# EAGLE design sensor (EAGLE 7.7.0)
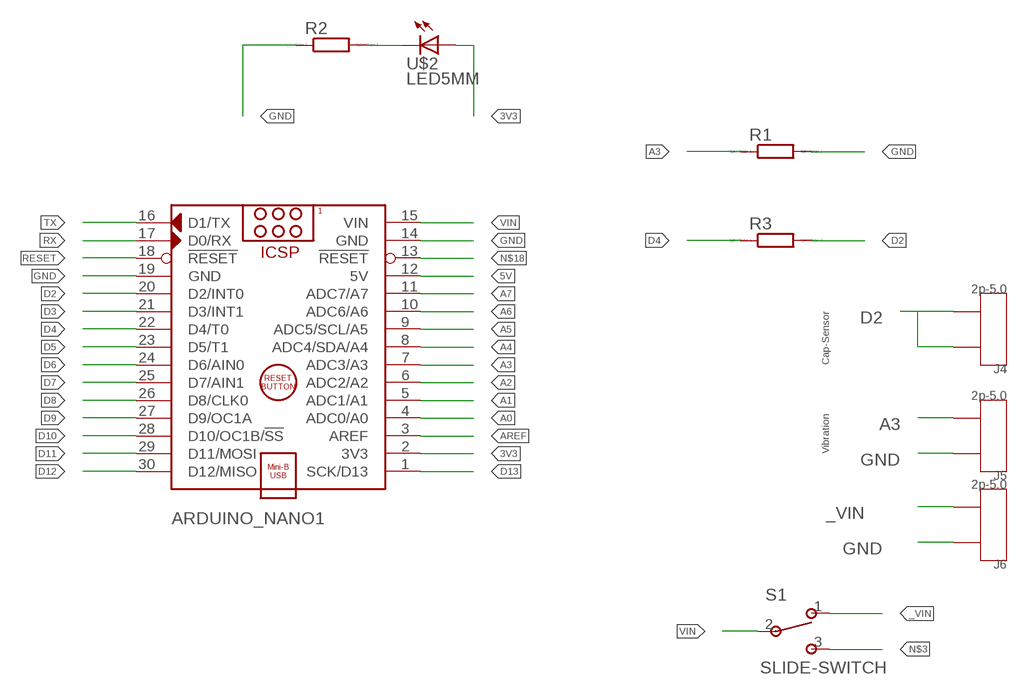
[diagram p0: schematic, sheet 1]

## Parts
ARDUINO_NANO1  ARDUINO_NANO  [ARDUINO_NANO]
J4  2p-5.0  DIP-FEMALE-BLUE(2P-5.0)  [H2-5.0]
J5  2p-5.0  DIP-FEMALE-BLUE(2P-5.0)  [H2-5.0]
J6  2p-5.0  DIP-FEMALE-BLUE(2P-5.0)  [H2-5.0]
R1  R0204/7  [0204/7]
R2  R0204/7  [0204/7]
R3  R0204/7  [0204/7]
S1  SLIDE-SWITCH  [AYZ0102AGRLC]
U$2  LED5MM  [5MM]

## Nets
3V3: ARDUINO_NANO1.2(3V3) U$2.IN(A)
5V: ARDUINO_NANO1.12(5V)
_VIN: J6.2 S1.1
A0: ARDUINO_NANO1.4(ADC0/A0)
A1: ARDUINO_NANO1.5(ADC1/A1)
A2: ARDUINO_NANO1.6(ADC2/A2)
A3: ARDUINO_NANO1.7(ADC3/A3) J5.2 R1.1
A4: ARDUINO_NANO1.8(ADC4/SDA/A4)
A5: ARDUINO_NANO1.9(ADC5/SCL/A5)
A6: ARDUINO_NANO1.10(ADC6/A6)
A7: ARDUINO_NANO1.11(ADC7/A7)
AREF: ARDUINO_NANO1.3(AREF)
D2: ARDUINO_NANO1.20(D2/INT0) J4.1 J4.2 R3.2
D3: ARDUINO_NANO1.21(D3/INT1)
D4: ARDUINO_NANO1.22(D4/T0) R3.1
D5: ARDUINO_NANO1.23(D5/T1)
D6: ARDUINO_NANO1.24(D6/AIN0)
D7: ARDUINO_NANO1.25(D7/AIN1)
D8: ARDUINO_NANO1.26(D8/CLK0)
D9: ARDUINO_NANO1.27(D9/OC1A)
D10: ARDUINO_NANO1.28(D10/OC1B/!SS)
D11: ARDUINO_NANO1.29(D11/MOSI)
D12: ARDUINO_NANO1.30(D12/MISO)
D13: ARDUINO_NANO1.1(SCK/D13)
GND: ARDUINO_NANO1.14(GND) ARDUINO_NANO1.19(GND) J5.1 J6.1 R1.2 R2.1
N$1: R2.2 U$2.OUT(C)
N$3: S1.3
N$18: ARDUINO_NANO1.13(!RESET)
RESET: ARDUINO_NANO1.18(!RESET)
RX: ARDUINO_NANO1.17(D0/RX)
TX: ARDUINO_NANO1.16(D1/TX)
VIN: ARDUINO_NANO1.15(VIN) S1.2

## Notes on the sheet
- Cap-Sensor
- Vibration

## Library data of the parts
ARDUINO_NANO1 = ArduinoNanoV30:ARDUINO_NANO: Arduino Nano V3.0 Module Overview: The Arduino Nano is a small, complete, and breadboard-friendly board based on the ATmega328 (Arduino Nano 3.x) or ATmega168 (Arduino Nano 2.x). It has more or less the same functionality of the Arduino Duemilanove, but in a different package. It lacks only a DC power jack, and works with a Mini-B USB cable instead of a standard one. The Nano was designed and is being produced by Gravitech <http://www.gravitech.us/arna30wiatp.html>. General specifications: Item Value Microcontroller Atmel ATmega168 or ATmega328 Operating Voltage (logic level) 5 V Input Voltage (recommended) 7-12 V Input Voltage (limits) 6-20 V Digital I/O Pins 14 (of which 6 provide PWM output) Analog Input Pins 8 DC Current per I/O Pin 40 mA Flash Memory 16 KB (ATmega168) or 32 KB (ATmega328) of which 2 KB used by bootloader SRAM 1 KB (ATmega168) or 2 KB (ATmega328) EEPROM 512 bytes (ATmega168) or 1 KB (ATmega328) Clock Speed 16 MHz Dimensions (Inches) 0.73" x 1.70" Dimensions (mm) 18mm x 45mm Overall height About 9 mm (not including pins) Weigth 5 g Power: The Arduino Nano can be powered via the Mini-B USB connection, 6-20V unregulated external power supply (pin 30), or 5V regulated external power supply (pin 27). The power source is automatically selected to the highest voltage source. Memory: The ATmega168 has 16 KB of flash memory for storing code (of which 2 KB is used for the bootloader); the ATmega328 has 32 KB, (also with 2 KB used for the bootloader). The ATmega168 has 1 KB of SRAM and 512 bytes of EEPROM (which can be read and written with the EEPROM library); the ATmega328 has 2 KB of SRAM and 1 KB of EEPROM. Input and Output: Each of the 14 digital pins on the Nano can be used as an input or output, using pinMode(), digitalWrite(), and digitalRead() functions. They operate at 5 volts. Each pin can provide or receive a maximum of 40 mA and has an internal pull-up resistor (disconnected by default) of 20-50 kOhms. In addition, some pins have specialized functions. Visit Arduino - ArduinoBoardNano <https://www.arduino.cc/en/Main/ArduinoBoardNano>
J4-J6 = Seeed-OPL-Connector:DIP-FEMALE-BLUE(2P-5.0): 320120007
R1-R3 = eagle-ltspice:R: RESISTOR, European symbol; SPICEMODEL: NONE; SPICEPREFIX: R
S1 = fab:SLIDE-SWITCH: SMD slide-switch AYZ0102AGRLC as found in the fablab inventory. Includes the mounting holes. Made by Zaerc.
U$2 = fab:LED: LED

## Board
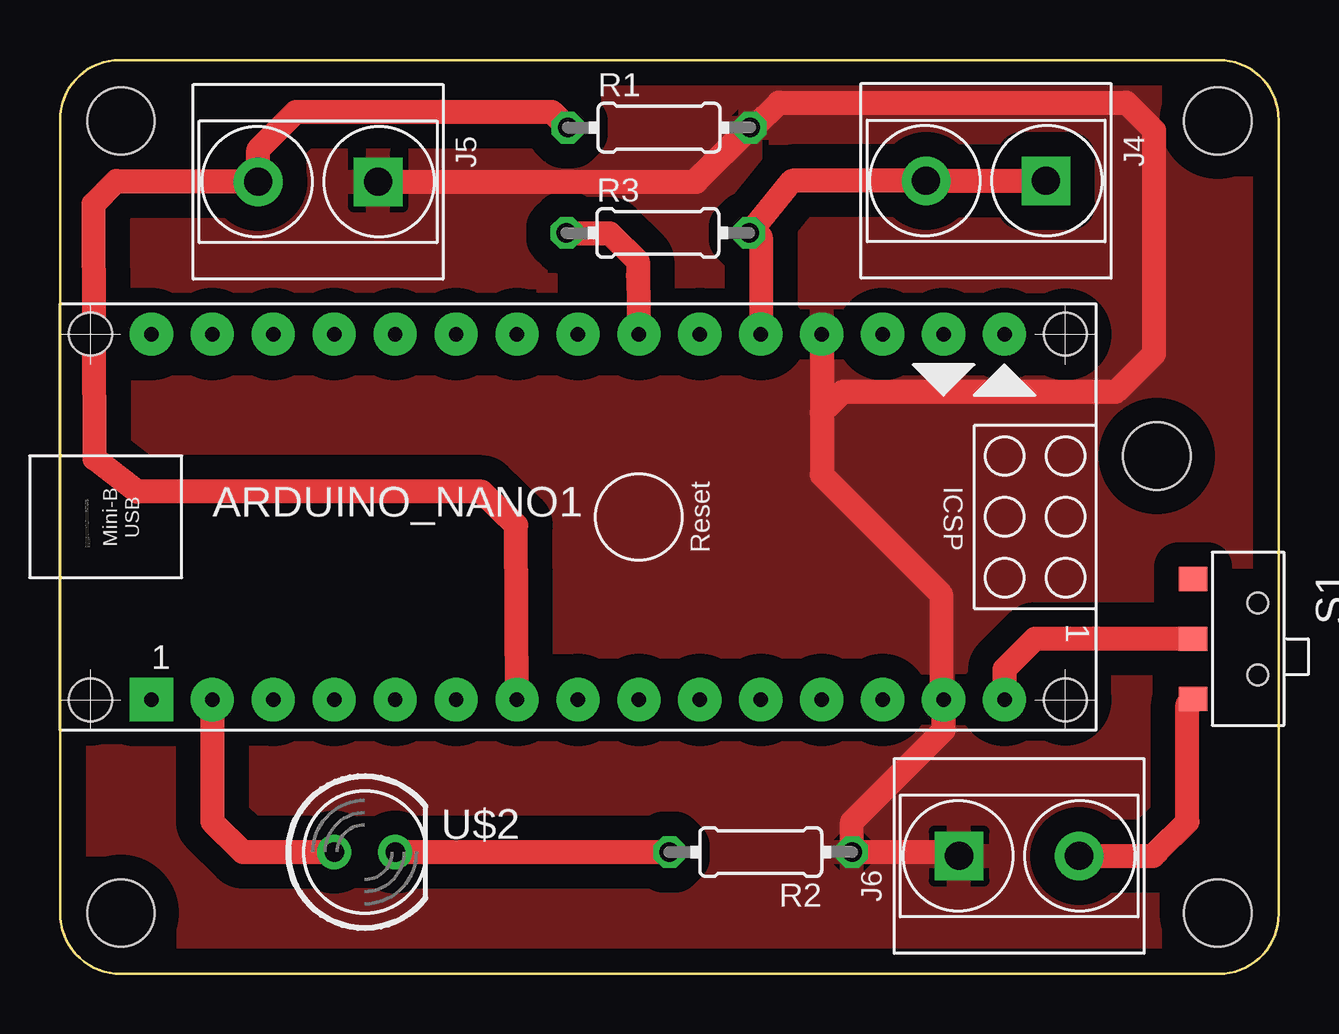
[diagram p1: board, top side]
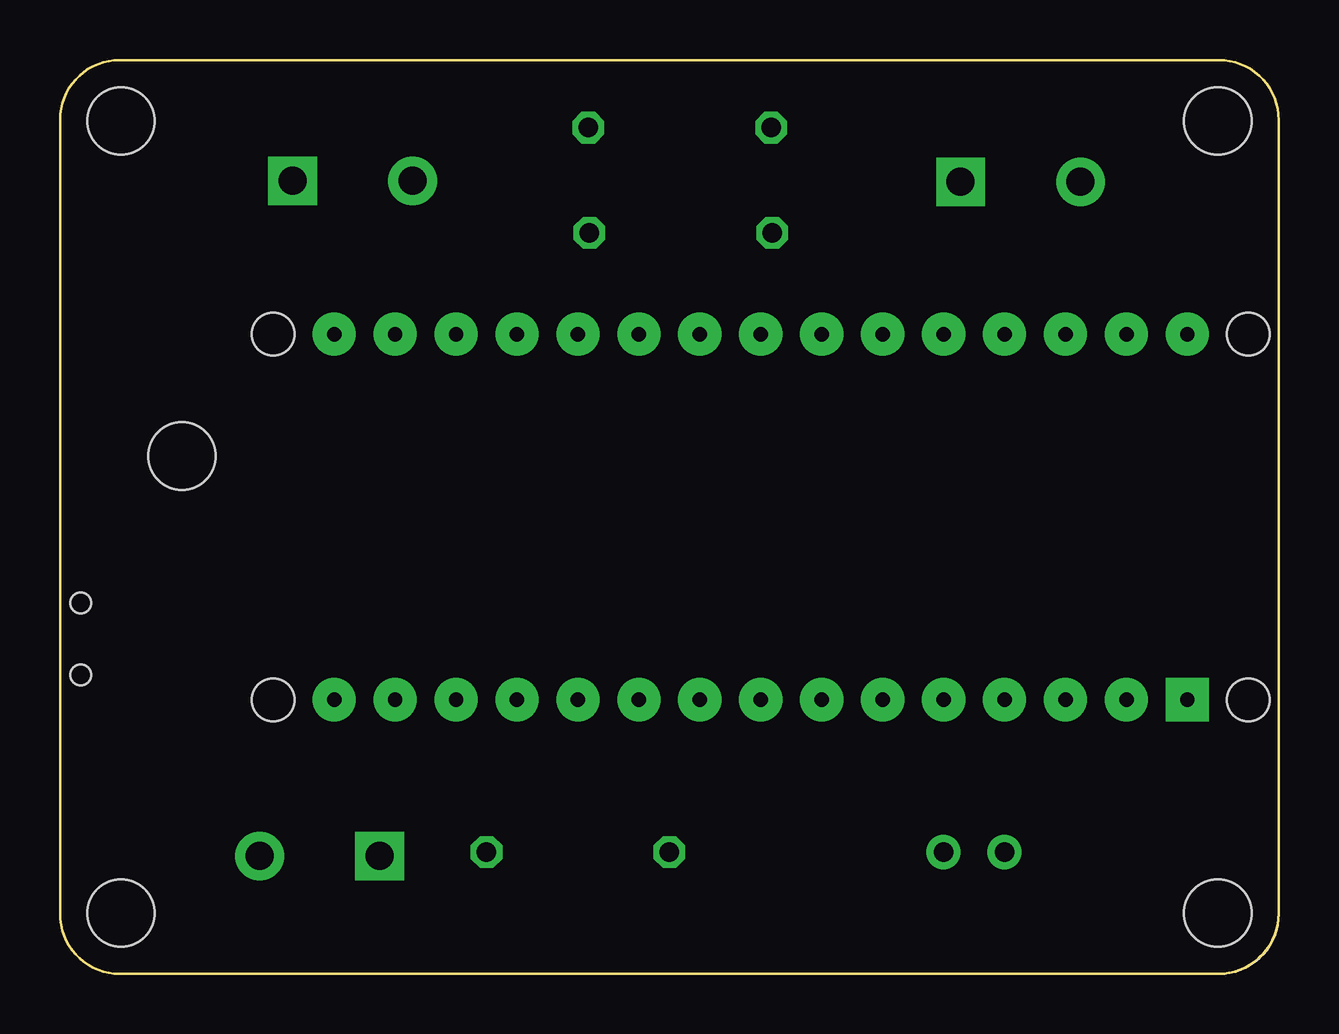
[diagram p2: board, bottom side, seen from below]

Size 50.8 x 38.1 mm. Coordinates in mm from the lower left corner, seen from the top.
Outline: 0,2.54 0,35.6 arc-90 2.5,38.1 48.3,38.1 arc-90 50.8,35.6 50.8,2.5 arc-90 48.3,0 2.54,0
Outline: 0,2.54 0,2.5
Outline: 2.5,0 2.54,0
Outline: 0,2.54 arc90 2.54,0
Copper layers (1*16): Top 0.035mm / dielectric 1.5mm / Bottom 0.035mm
Design rules "fabmodule": minimum track width 10mil, minimum drill 0.4mm, track to track 0.42mm, track to pad 0.42mm, pad to pad 0.42mm, via to via 0.42mm, smd to smd 0.42mm, copper to edge 40mil, drill to drill 0.8mm, minimum pad ring 10mil, minimum via ring 8mil, stop-mask expansion 4mil, vias tented up to drill 0mil, thermal gap 10mil
Holes 2.8 mm at 48.26,35.56 48.26,2.54 2.54,2.54 2.54,35.56 45.72,21.59

### Footprints (pad centres in the part's own frame; a part is rotated, then mirrored left to right if it is on the bottom)
ARDUINO_NANO = drill 0.6 pad 1.8 square: 1 -20.32,-7.62 | drill 0.6 pad 1.8: 2 -17.78,-7.62; 3 -15.24,-7.62; 4 -12.7,-7.62; 5 -10.16,-7.62; 6 -7.62,-7.62; 7 -5.08,-7.62; 8 -2.54,-7.62; 9 0,-7.62; 10 2.54,-7.62; 11 5.08,-7.62; 12 7.62,-7.62; 13 10.16,-7.62; 14 12.7,-7.62; 15 15.24,-7.62; 16 15.24,7.62; 17 12.7,7.62; 18 10.16,7.62; 19 7.62,7.62; 20 5.08,7.62; 21 2.54,7.62; 22 0,7.62; 23 -2.54,7.62; 24 -5.08,7.62; 25 -7.62,7.62; 26 -10.16,7.62; 27 -12.7,7.62; 28 -15.24,7.62; 29 -17.78,7.62; 30 -20.32,7.62 | hole 1.778: -22.86,-7.62; -22.86,7.62; 17.78,7.62; 17.78,-7.62
H2-5.0 = drill 1.168 pad 2.032 square: 1 0,2.5 | drill 1.168 pad 2.032: 2 0,-2.5
0204/7 = drill 0.813 octagon: 1 -3.81,0; 2 3.81,0
AYZ0102AGRLC = smd 1 x 1.2: 1 2.5,-2.3; 2 0,-2.3; 3 -2.5,-2.3 | hole 0.85: -1.5,0.4; 1.5,0.4
5MM = drill 0.813 pad 1.422: IN -1.27,0; OUT 1.27,0

### Placement (x,y rotation side)
ARDUINO_NANO1  24.13,19.05 0 top
J4  38.6,33.06 270 top
J5  10.76,33.02 270 top
J6  39.98,4.91 90 top
R1  24.97,35.28 0 top
R2  29.21,5.08 180 top
R3  24.92,30.89 0 top
S1  49.53,13.97 270 top
U$2  12.7,5.08 0 top

### Tracks (layer width: path | path; a pad name or v marks a point on that pad's centre or on a via)
3V3
  Top 1: ARDUINO_NANO1.2 6.35,6.35 7.62,5.08 U$2.IN
_VIN
  Top 1: S1.1 46.99,11.23 46.99,6.35 45.72,5.08 45.55,4.91 J6.2
A3
  Top 1: R1.1 20.5,35.93 9.84,35.93 8.26,34.36 J5.2 8.23,33.05 2.35,33.05 1.4,32.1 1.44,21.48 3.23,20.1 17.58,20.1 19.02,18.7 ARDUINO_NANO1.7
D2
  Top 1: ARDUINO_NANO1.20 29.22,30.72 R3.2 30.52,33.06 J4.2 J4.1
D4
  Top 1: R3.1 22.91,30.88 24.08,29.71 24.08,29.12 ARDUINO_NANO1.22
GND
  Top 0.3: 12.63,32.39 J5.1
  Top 1: J6.1 37.31,5.08 R2.1 33.02,6.35 36.83,10.16 ARDUINO_NANO1.14 36.73,11.53 36.73,15.81 31.75,20.8 31.75,23.4 | J5.1 26.52,33.02 | 26.52,33.02 R1.2 | ARDUINO_NANO1.19 31.75,23.4 | 26.52,33.02 26.52,33.09 28.74,35.31 28.95,35.31 29.96,36.32 44.44,36.32 45.59,35.17 45.59,25.85 44.01,24.26 32.62,24.26 31.75,23.4
  pour Top (isolate 1.016): 1.56,39.53 48.39,39.53 arc-90 52.46,35.46 52.46,2.5 arc-90 48.83,-1.13 2.6,-1.13 arc-90 -1.21,2.69 -1.21,36.93 arc-90 1.33,39.48 1.58,39.48
N$1
  Top 1: U$2.OUT R2.2
VIN
  Top 1: S1.2 40.64,13.97 39.37,12.7 ARDUINO_NANO1.15